# EAGLE design SwrMetter (EAGLE 6.1)
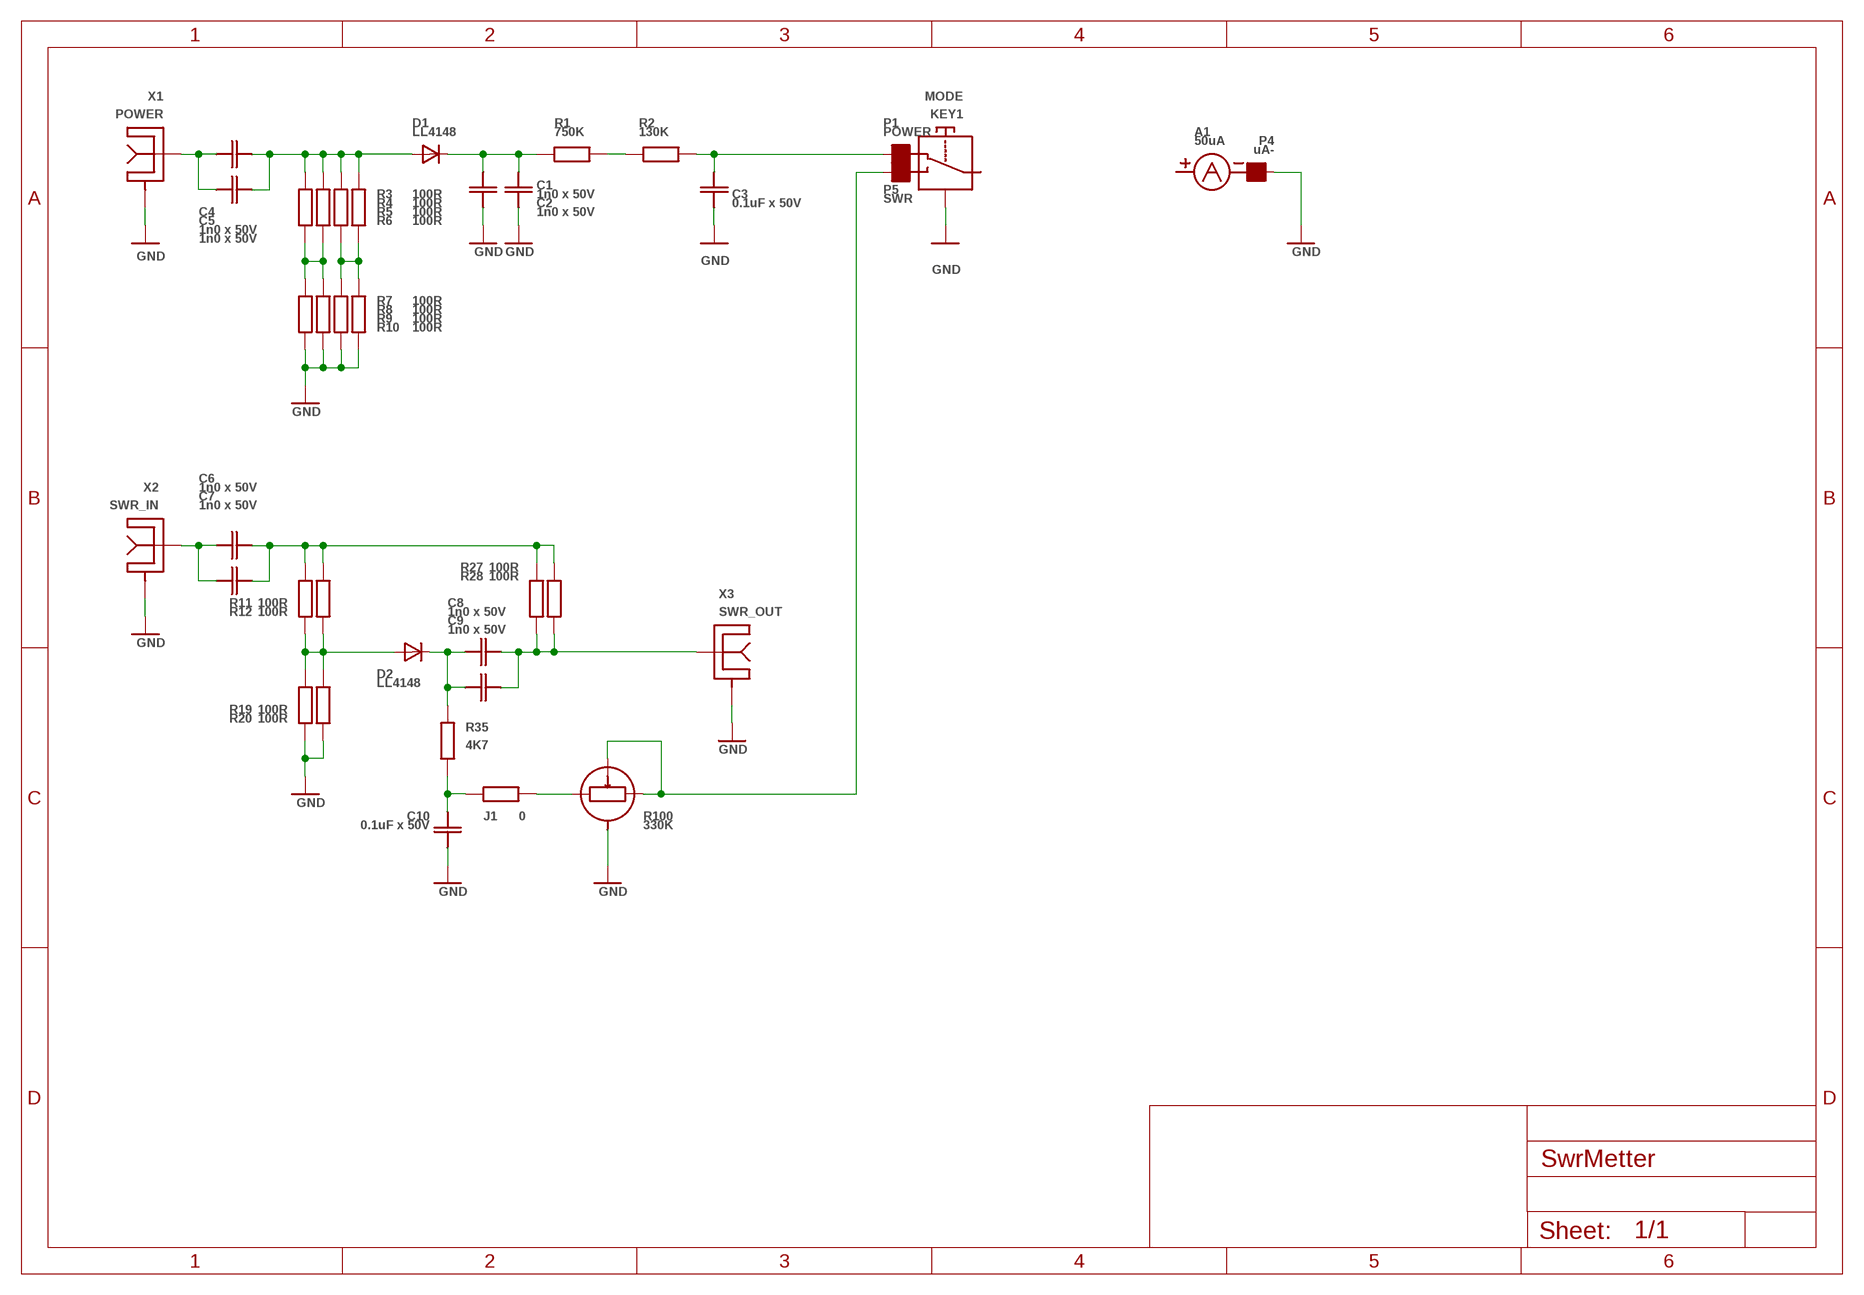
[diagram p0: schematic, sheet 1]

## Parts
A1  50uA  AMPERMETER_NO_PIN(CHINA_MICRO_AMPM)  [MICRO_AMPMET(UNKNOWN)]
C1  1n0 x 50V  CSMD_1206  [RSMD_1206]
C2  1n0 x 50V  CSMD_1206  [RSMD_1206]
C3  0.1uF x 50V  CSMD_1206  [RSMD_1206]
C4  1n0 x 50V  CSMD_1206  [RSMD_1206]
C5  1n0 x 50V  CSMD_1206  [RSMD_1206]
C6  1n0 x 50V  CSMD_1206  [RSMD_1206]
C7  1n0 x 50V  CSMD_1206  [RSMD_1206]
C8  1n0 x 50V  CSMD_1206  [RSMD_1206]
C9  1n0 x 50V  CSMD_1206  [RSMD_1206]
C10  0.1uF x 50V  CSMD_1206  [RSMD_1206]
D1  LL4148  LL4147SOD-80  [SOD-80]
D2  LL4148  LL4147SOD-80  [SOD-80]
J1  0  RSMD_2512  [RSMD_2512]
KEY1  MODE  KEY_2POS_NO_PINSMTS1  [KEY_MTS1_NO_PINS]
P1  POWER  PADPAD_4X4  [PAD_4X4]
P4  uA-  PADPAD_4X4  [PAD_4X4]
P5  SWR  PADPAD_4X4  [PAD_4X4]
R1  750K  RSMD_1206  [RSMD_1206]
R2  130K  RSMD_1206  [RSMD_1206]
R3  100R  RSMD_2512  [RSMD_2512]
R4  100R  RSMD_2512  [RSMD_2512]
R5  100R  RSMD_2512  [RSMD_2512]
R6  100R  RSMD_2512  [RSMD_2512]
R7  100R  RSMD_2512  [RSMD_2512]
R8  100R  RSMD_2512  [RSMD_2512]
R9  100R  RSMD_2512  [RSMD_2512]
R10  100R  RSMD_2512  [RSMD_2512]
R11  100R  RSMD_2512  [RSMD_2512]
R12  100R  RSMD_2512  [RSMD_2512]
R19  100R  RSMD_2512  [RSMD_2512]
R20  100R  RSMD_2512  [RSMD_2512]
R27  100R  RSMD_2512  [RSMD_2512]
R28  100R  RSMD_2512  [RSMD_2512]
R35  4K7  RSMD_0805  [RSMD_0805]
R100  330K  R_ADJ_WITH_SHIELDSP4-AM  [SP3-4AM]
X1  POWER  PL239_FEM4SCREWS  [PL-239(FEMALE)]
X2  SWR_IN  PL239_FEM4SCREWS  [PL-239(FEMALE)]
X3  SWR_OUT  PL239_FEM4SCREWS  [PL-239(FEMALE)]

## Nets
GND: C1.PAD_0(PIN0) C2.PAD_0(PIN0) C3.PAD_0(PIN0) C10.PAD_1(PIN1) KEY1.GND1(PACKAGE) KEY1.GND2(PACKAGE) P4.PAD(PIN1) R7.PAD0(PIN0) R8.PAD0(PIN0) R9.PAD0(PIN0) R10.PAD0(PIN0) R19.PAD0(PIN0) R20.PAD0(PIN0) R100.PACKAGE1(PACKAGE) R100.PACKAGE2(PACKAGE) X1.CENTER_DRILL(GND) X1.SCREW1(GND) X1.SCREW2(GND) X1.SCREW3(GND) X1.SCREW4(GND) X2.CENTER_DRILL(GND) X2.SCREW1(GND) X2.SCREW2(GND) X2.SCREW3(GND) X2.SCREW4(GND) X3.CENTER_DRILL(GND) X3.SCREW1(GND) X3.SCREW2(GND) X3.SCREW3(GND) X3.SCREW4(GND)
N$1: J1.PAD0(PIN0) R100.END_A
N$2: C4.PAD_0(PIN0) C5.PAD_0(PIN0) D1.ANODE R3.PAD1(PIN1) R4.PAD1(PIN1) R5.PAD1(PIN1) R6.PAD1(PIN1)
N$3: C4.PAD_1(PIN1) C5.PAD_1(PIN1) X1.SIGNAL
N$4: C6.PAD_1(PIN1) C7.PAD_1(PIN1) X2.SIGNAL
N$5: C6.PAD_0(PIN0) C7.PAD_0(PIN0) R11.PAD1(PIN1) R12.PAD1(PIN1) R27.PAD1(PIN1) R28.PAD1(PIN1)
N$6: P5.PAD(PIN1) R100.END_B R100.MIDDLE
N$7: C8.PAD_1(PIN1) C9.PAD_1(PIN1) D2.CATHODE R35.PAD_1(PIN1)
N$8: C10.PAD_0(PIN0) J1.PAD1(PIN1) R35.PAD_0(PIN0)
N$18: D2.ANODE R11.PAD0(PIN0) R12.PAD0(PIN0) R19.PAD1(PIN1) R20.PAD1(PIN1)
N$21: R3.PAD0(PIN0) R4.PAD0(PIN0) R7.PAD1(PIN1) R8.PAD1(PIN1)
N$29: R5.PAD0(PIN0) R6.PAD0(PIN0) R9.PAD1(PIN1) R10.PAD1(PIN1)
N$30: C8.PAD_0(PIN0) C9.PAD_0(PIN0) R27.PAD0(PIN0) R28.PAD0(PIN0) X3.SIGNAL
N$43: C1.PAD_1(PIN1) C2.PAD_1(PIN1) D1.CATHODE R1.PAD_1(PIN1)
N$44: R1.PAD_0(PIN0) R2.PAD_1(PIN1)
N$45: C3.PAD_1(PIN1) P1.PAD(PIN1) R2.PAD_0(PIN0)

## Library data of the parts
A1 = __MyCommonLib1:AMPERMETER_NO_PIN
C1-C10 = __MyCommonLib1:C
D1 D2 = __MyCommonLib1:LL4147
J1 R1-R12 R19 R20 R27 R28 R35 = __MyCommonLib1:R
KEY1 = __MyCommonLib1:KEY_2POS_NO_PINS
P1 P4 P5 = __MyCommonLib1:PAD
R100 = __MyCommonLib1:R_ADJ_WITH_SHIELD
X1-X3 = __MyCommonLib1:PL239_FEM

## Board
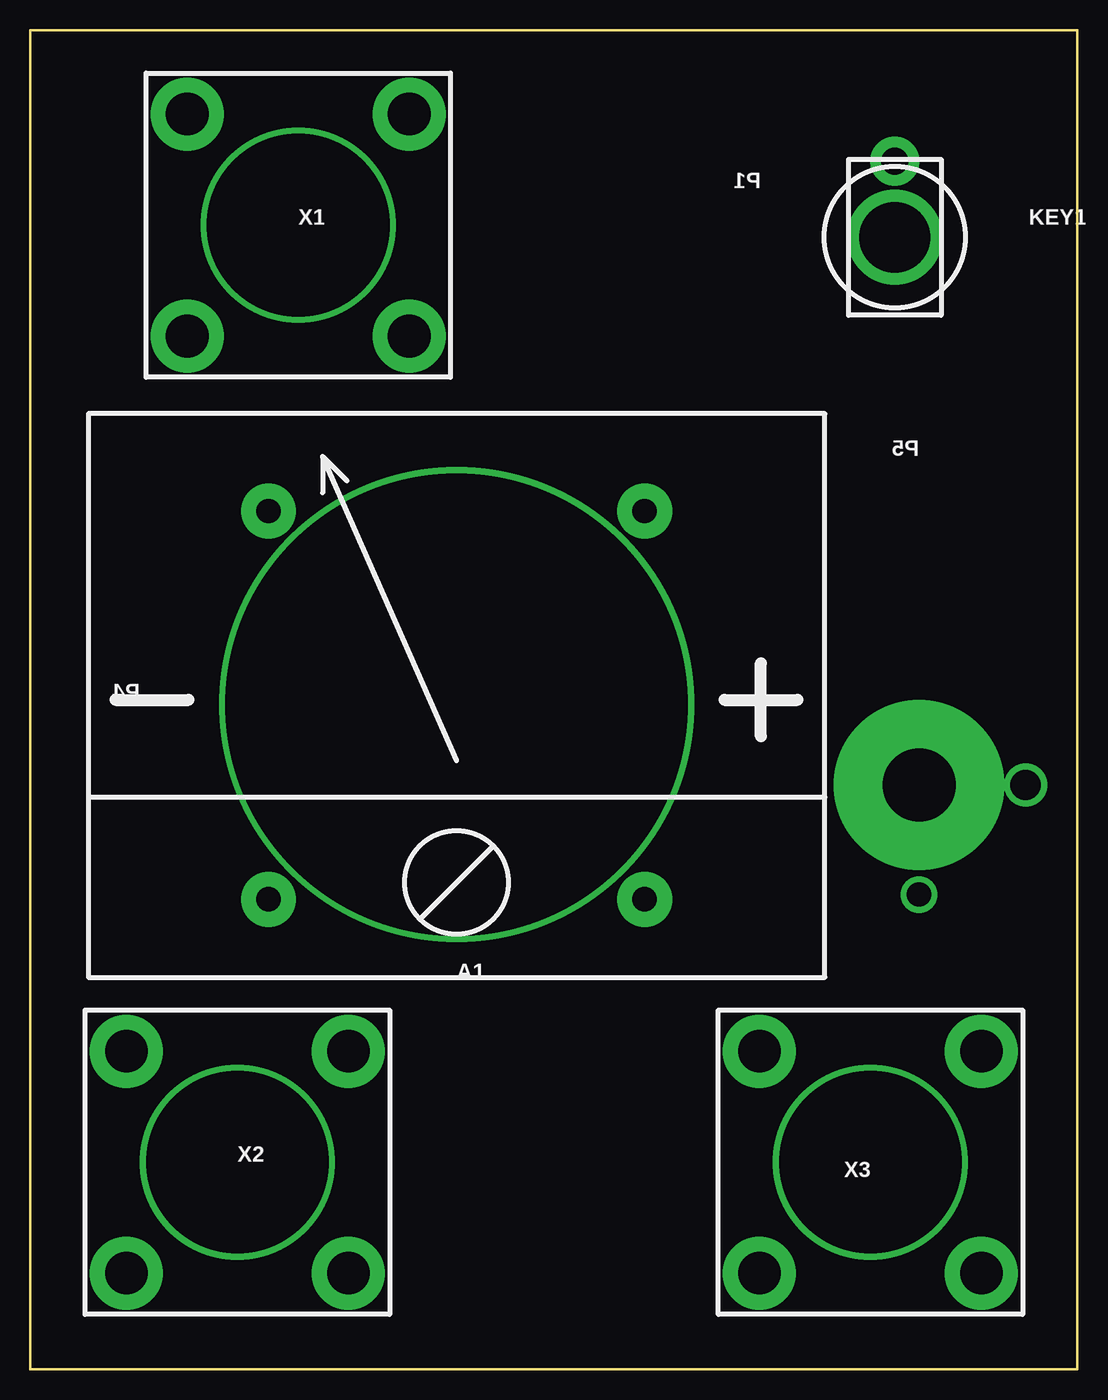
[diagram p1: board, top side]
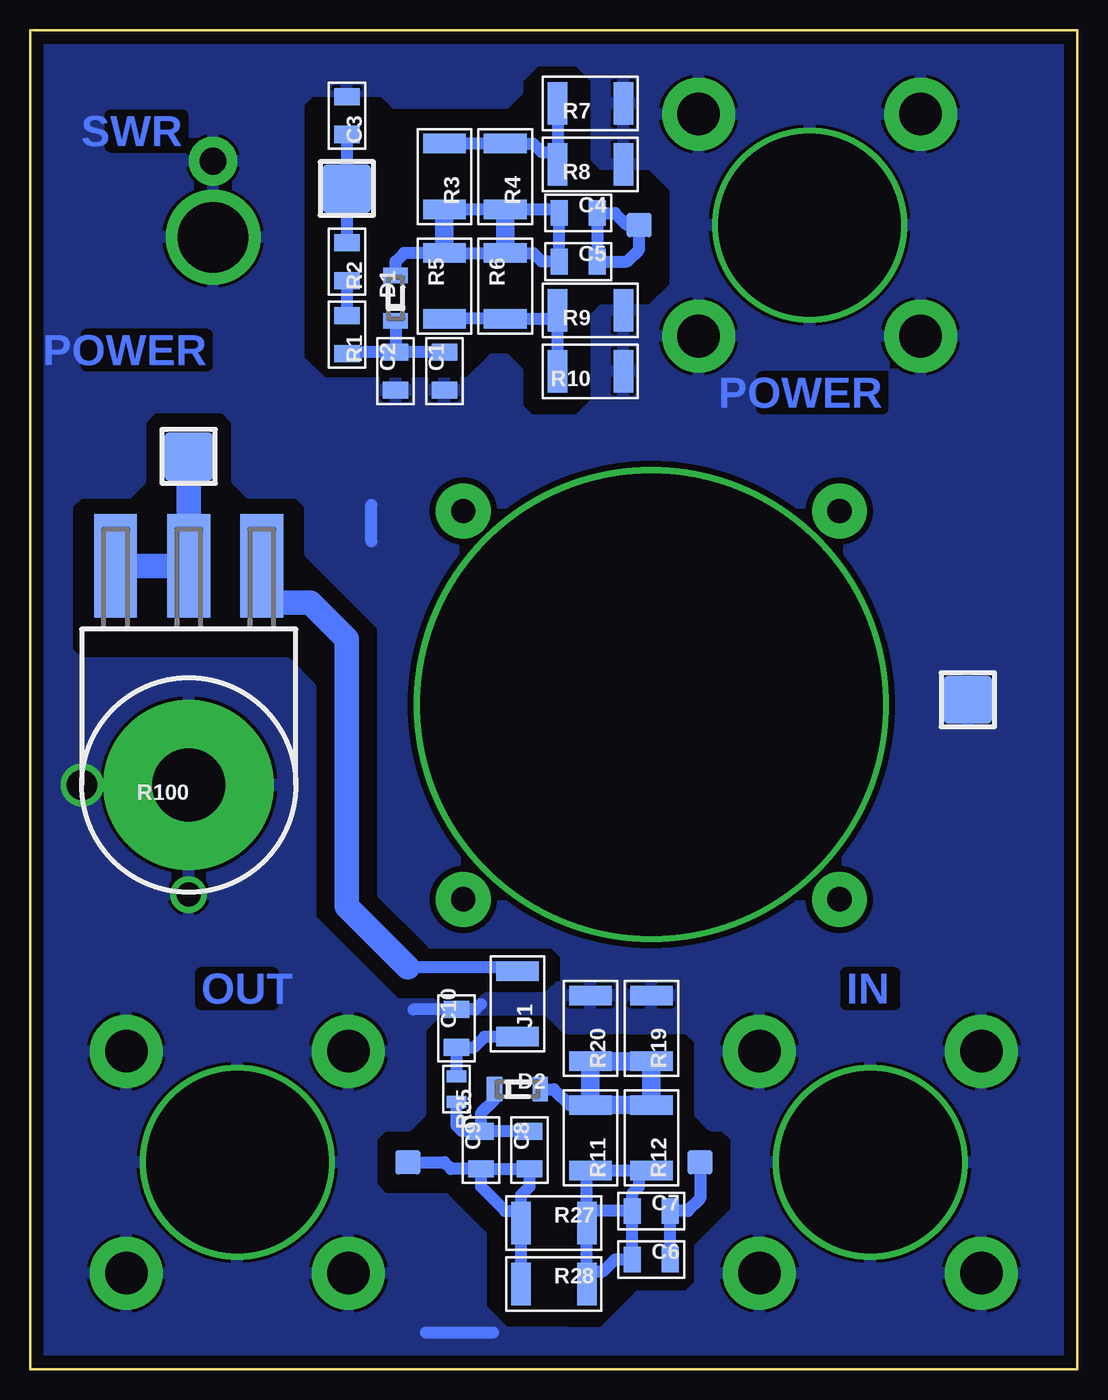
[diagram p2: board, bottom side, seen from below]

Size 86 x 110 mm. Coordinates in mm from the lower left corner, seen from the top.
Outline: 0,0 86,0 86,110 0,110 0,0
Copper layers (1*16): Top 0.035mm / dielectric 1.5mm / Bottom 0.035mm
Design rules: minimum track width 10mil, minimum drill 24mil, track to track 8mil, track to pad 8mil, pad to pad 8mil, via to via 8mil, smd to smd 8mil, copper to edge 40mil, drill to drill 8mil, minimum pad ring 10mil, minimum via ring 8mil, stop-mask expansion 4mil, vias tented up to drill 0mil, thermal gap 10mil

### Footprints (pad centres in the part's own frame; a part is rotated, then mirrored left to right if it is on the bottom)
MICRO_AMPMET(UNKNOWN) = drill 38 pad 39: CENTER_DRILL 0,22.6 | drill 2 pad 4.5: SCREW1 -15.45,38.5; SCREW2 15.45,38.5; SCREW3 -15.45,6.6; SCREW4 15.45,6.6
RSMD_1206 = smd 1.4 x 2.1: PAD_0 -1.55,0; PAD_1 1.55,0
SOD-80 = smd 1.25 x 2: ANODE 1.875,0; CATHODE -1.875,0
RSMD_2512 = smd 1.6 x 3.5: PAD0 -2.7,0; PAD1 2.7,0
KEY_MTS1_NO_PINS = drill 2.2 pad 4: GND1 0,6.25 | drill 5.8 pad 7.8: GND2 0,0
PAD_4X4 = smd 4 x 4: PAD 0,0
RSMD_0805 = smd 1 x 1.6: PAD_0 -1.05,0; PAD_1 1.05,0
SP3-4AM = smd 3.5 x 8.5: END_A -6,-18; END_B 6,-18; MIDDLE 0,-18 | drill 6 pad 14: PACKAGE1 0,0 | drill 2 pad 3: PACKAGE2 0,9
PL-239(FEMALE) = drill 15 pad 16: CENTER_DRILL 0,0 | drill 3.5 pad 6: SCREW1 -9.12,9.12; SCREW2 9.12,9.12; SCREW3 -9.12,-9.12; SCREW4 9.12,-9.12 | smd 2 x 2 bottom: SIGNAL 14,0

### Placement (x,y rotation side)
A1  35,32 0 top
C1  52,82 90 bottom
C2  56,82 90 bottom
C3  60,103 270 bottom
C4  41,95 0 bottom
C5  41,91 0 bottom
C6  35,9 0 bottom
C7  35,13 0 bottom
C8  45,18 90 bottom
C9  49,18 90 bottom
C10  51,28 90 bottom
D1  56,88 90 bottom
D2  46,23 0 bottom
J1  46,30 270 bottom
KEY1  71,93 0 top
P1  60,97 0 bottom
P4  9,55 0 bottom
P5  73,75 0 bottom
R1  60,85 270 bottom
R2  60,91 270 bottom
R3  52,98 270 bottom
R4  47,98 270 bottom
R5  52,89 90 bottom
R6  47,89 90 bottom
R7  40,104 180 bottom
R8  40,99 180 bottom
R9  40,87 180 bottom
R10  40,82 180 bottom
R11  40,19 270 bottom
R12  35,19 270 bottom
R19  35,28 270 bottom
R20  40,28 270 bottom
R27  43,12 0 bottom
R28  43,7 0 bottom
R35  51,23 270 bottom
R100  73,48 180 bottom
X1  22,94 0 top
X2  17,17 0 top
X3  69,17 180 top

### Tracks (layer width: path | path; a pad name or v marks a point on that pad's centre or on a via)
GND  (via drill 2.5)
  Bottom 1: 49,30 49.45,29.55 C10.PAD_1 54.55,29.55 | 58,68 58,71 | 48,3 53.5,3
  other vias: 81.75,48
  pour Bottom (isolate 0.5): 46,3 39,3 36,6 32,6 31,7 31,10 28,13 28,19 29,20 30,20 31,21 31,27 32,28 42,28 43.5,29.5 49.5,29.5 48.5,30.5 43.5,30.5 42,32 42,34 43,35 53,35 57,39 57,62 59,64 59,81 50,81 48,83 47,83 46,82 46,79 45,78 41,78 39.5,79.5 39.5,86.5 39,87 35,87 33,89 33,97 35,99 39,99 39.5,99.5 39.5,106 41,107.5 44.5,107.5 46,106 46,105 47,104 56,104 57,105 63,105 64,104 64,83 62,81 61,81 61,72 68,72 69,73 69,78 70,79 76,79 77,78 77,73 78,72 82,72 83,71 83,59 82,58 65,58 63,56 63,37 56,30 53,30 53,29 54,28 54,21 55,20 57,20 58,19 58,15 57,14 52,14 49,11 49,1 85,1 85,109 1,109 1,1 46,1
  pour Bottom: 57,61 63,67 63,71 64,72 64,81 59,81 59,78 57,76
  pour Bottom: 46,3 47,3 49,5 50,5 50,1.5 42,1.5 42,3
N$1
  Bottom 1: J1.PAD0 46.3,33 55,33
  Bottom 2: 55,33 60,38 60,60 63,63 67,63 R100.END_A
N$2
  Bottom 1: R3.PAD1 R4.PAD1 42.85,95.3 C4.PAD_0 C5.PAD_0 44,91 44.7,91.7 R6.PAD1 47,92 47.3,91.7 R5.PAD1 55.3,91.7 56,91 D1.ANODE
  Bottom 1.5: 47,95 47,92 | R5.PAD1 R3.PAD1
N$3
  Bottom 1: C5.PAD_1 39,91 | 39,91 37,91 36,92 X1.SIGNAL 37,94 38,95 C4.PAD_1 39.45,91.45 39,91
N$4
  Bottom 1: X2.SIGNAL 31,14 32,13 C7.PAD_1 C6.PAD_1
N$5
  Bottom 1: R12.PAD1 36,16.3 | 36,16.3 R11.PAD1 40.3,16.3 R27.PAD1 R28.PAD1 | C7.PAD_0 36.55,14.45 36,15 36,16.3 | C7.PAD_0 40,13 | 40,8 39,8 38,9 C6.PAD_0 C7.PAD_0
N$6
  Bottom 2: P5.PAD R100.MIDDLE R100.END_B
N$7
  Bottom 1: C8.PAD_1 C9.PAD_1 | C9.PAD_1 50.55,19.55 51,20 R35.PAD_1 | D2.CATHODE 47.88,22.12 49,21 C9.PAD_1
N$8
  Bottom 1: R35.PAD_0 C10.PAD_0 49.55,26.45 48.7,27.3 J1.PAD1
N$18
  Bottom 1: D2.ANODE 43,23 41.7,21.7 R11.PAD0
  Bottom 1.5: 35,22 R19.PAD1 R20.PAD1 R11.PAD0 R12.PAD0
N$21
  Bottom 1: R3.PAD0 R4.PAD0 44.7,100.7 44,100 43,100 43,99.3 R8.PAD1 R7.PAD1
N$29
  Bottom 1: R5.PAD0 R6.PAD0 43.4,86.3 R9.PAD1 R10.PAD1
N$30
  Bottom 1: R28.PAD0 R27.PAD0 45.7,13 | 45.7,13 45.7,14.3 45,15 45,16 | 45,16 C8.PAD_0 | C9.PAD_0 49,15 47,13 45.7,13 | C9.PAD_0 45.45,16.45 45,16 | X3.SIGNAL 52,17 51.45,16.45 C9.PAD_0
N$43
  Bottom 1: C1.PAD_1 C2.PAD_1 | D1.CATHODE C2.PAD_1 | C2.PAD_1 59.9,83.55 R1.PAD_1
N$44
  Bottom 1: R2.PAD_1 R1.PAD_0
N$45
  Bottom 1: R2.PAD_0 P1.PAD C3.PAD_1

### Text on the board
Bottom: SWR | POWER | POWER | IN | OUT